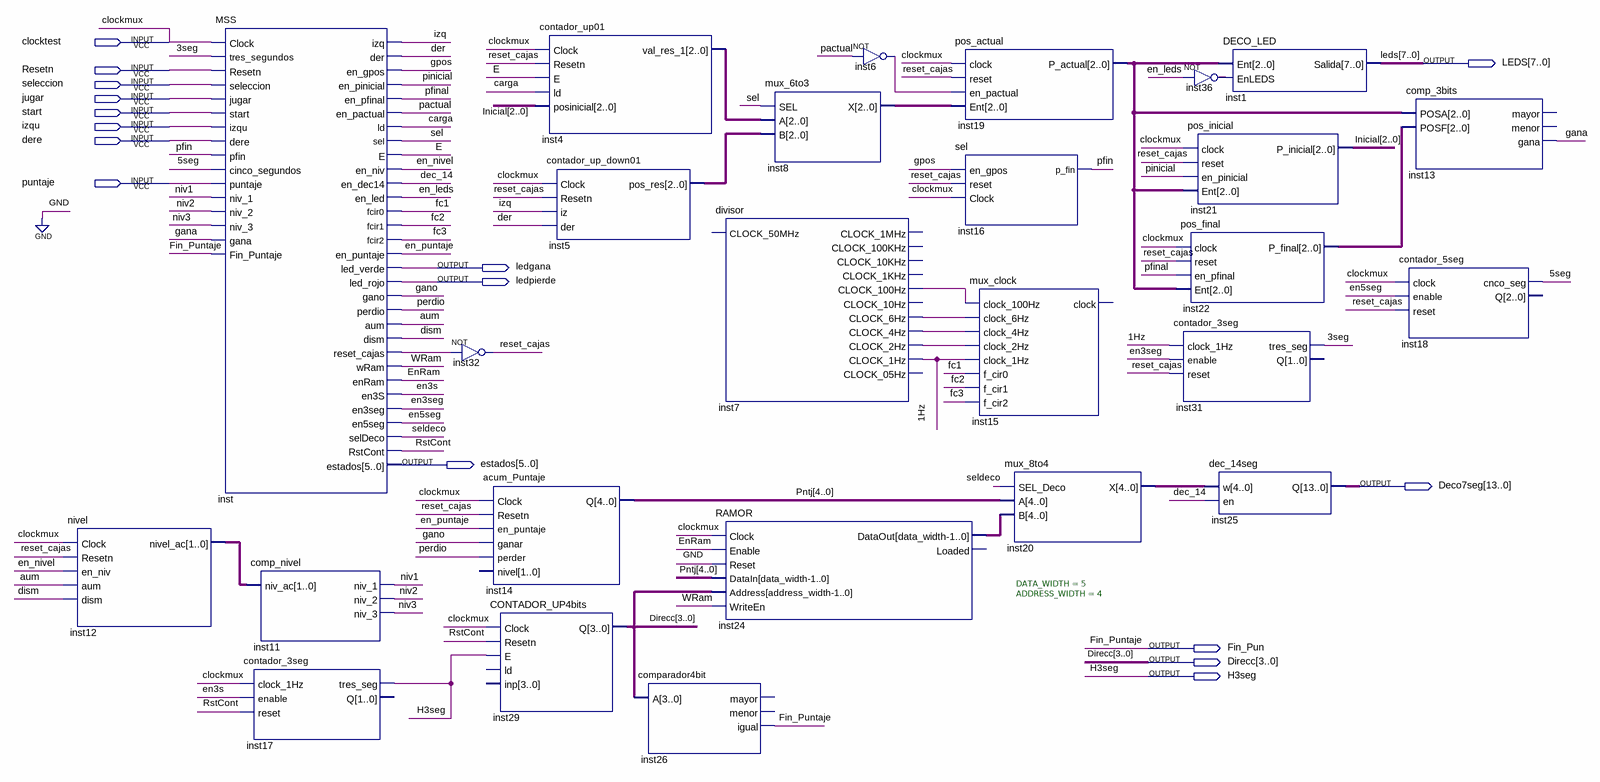
[diagram p0: schematic sheet]
// Quartus schematic diagrama_bloques2.bdf as structural Verilog: 26 symbols, 16 pins
module diagrama_bloques2 (
  input  clocktest,
  input  Resetn,
  input  seleccion,
  input  jugar,
  input  start,
  input  izqu,
  input  dere,
  input  puntaje,
  output [7:0] LEDS,
  output ledgana,
  output ledpierde,
  output [5:0] estados,
  output [13:0] Deco7seg,
  output Fin_Pun,
  output [3:0] Direcc,
  output H3seg
);

  wire \1Hz , \3seg , \5seg , aum, carga, dec_14, der, dism, E, en3s, en3seg, en5seg, en_leds, en_nivel,
       en_puntaje, EnRam, fc1, fc2, fc3, gana, gano, gpos, inst6_out, inst7_clock_2hz, inst7_clock_4hz,
       inst7_clock_6hz, inst7_clock_100hz, inst36_out, inst_reset_cajas, izq, niv1, niv2, niv3, pactual,
       perdio, pfin, pfinal, pinicial, reset_cajas, RstCont, sel, seldeco, WRam;
  wire [1:0] inst12_nivel_ac;
  wire [2:0] Inicial, inst4_val_res_1, inst5_pos_res, inst8_x, inst19_p_actual, inst22_p_final;
  wire [4:0] inst20_x, inst24_dataout, Pntj;

  nivel inst12 (
    .Clock(clocktest), .Resetn(reset_cajas), .en_niv(en_nivel), .aum(aum), .dism(dism),
    .nivel_ac(inst12_nivel_ac));
  MSS inst (
    .Clock(clocktest), .tres_segundos(\3seg ), .Resetn(Resetn), .seleccion(seleccion), .jugar(jugar),
    .start(start), .izqu(izqu), .dere(dere), .pfin(pfin), .cinco_segundos(\5seg ), .puntaje(puntaje),
    .niv_1(niv1), .niv_2(niv2), .niv_3(niv3), .gana(gana), .Fin_Puntaje(Fin_Pun), .izq(izq), .der(der),
    .en_gpos(gpos), .en_pinicial(pinicial), .en_pfinal(pfinal), .en_pactual(pactual), .ld(carga), .sel(sel),
    .E(E), .en_niv(en_nivel), .en_dec14(dec_14), .en_led(en_leds), .fcir0(fc1), .fcir1(fc2), .fcir2(fc3),
    .en_puntaje(en_puntaje), .led_verde(ledgana), .led_rojo(ledpierde), .gano(gano), .perdio(perdio),
    .aum(aum), .dism(dism), .reset_cajas(inst_reset_cajas), .wRam(WRam), .enRam(EnRam), .en3S(en3s),
    .en3seg(en3seg), .en5seg(en5seg), .selDeco(seldeco), .RstCont(RstCont), .estados(estados));
  comp_nivel inst11 (.niv_ac(inst12_nivel_ac), .niv_1(niv1), .niv_2(niv2), .niv_3(niv3));
  contador_3seg inst17 (.clock_1Hz(clocktest), .enable(en3s), .reset(RstCont), .tres_seg(H3seg));  // open: Q
  not inst32 (reset_cajas, inst_reset_cajas);
  acum_Puntaje inst14 (
    .Clock(clocktest), .Resetn(reset_cajas), .en_puntaje(en_puntaje), .ganar(gano), .perder(perdio), .Q(Pntj));  // open: nivel
  CONTADOR_UP4bits inst29 (.Clock(clocktest), .Resetn(RstCont), .E(H3seg), .Q(Direcc));  // open: ld, inp
  contador_up01 inst4 (
    .Clock(clocktest), .Resetn(reset_cajas), .E(E), .ld(carga), .posinicial(Inicial),
    .val_res_1(inst4_val_res_1));
  contador_up_down01 inst5 (.Clock(clocktest), .Resetn(reset_cajas), .iz(izq), .der(der), .pos_res(inst5_pos_res));
  comparador4bit inst26 (.A(Direcc), .igual(Fin_Pun));  // open: mayor, menor
  divisor inst7 (
    .CLOCK_100Hz(inst7_clock_100hz), .CLOCK_6Hz(inst7_clock_6hz), .CLOCK_4Hz(inst7_clock_4hz),
    .CLOCK_2Hz(inst7_clock_2hz), .CLOCK_1Hz(\1Hz ));  // open: CLOCK_50MHz, CLOCK_1MHz, CLOCK_100KHz, CLOCK_10KHz, CLOCK_1KHz, CLOCK_10Hz, CLOCK_05Hz
  RAMOR #(.DATA_WIDTH(5), .ADDRESS_WIDTH(4)) inst24 (
    .Clock(clocktest), .Enable(EnRam), .Reset(1'b0), .DataIn(Pntj), .Address(Direcc), .WriteEn(WRam),
    .DataOut(inst24_dataout));  // open: Loaded
  mux_6to3 inst8 (.SEL(sel), .A(inst4_val_res_1), .B(inst5_pos_res), .X(inst8_x));
  not inst6 (inst6_out, pactual);
  pos_actual inst19 (
    .clock(clocktest), .reset(reset_cajas), .en_pactual(inst6_out), .Ent(inst8_x), .P_actual(inst19_p_actual));
  sel inst16 (.en_gpos(gpos), .reset(reset_cajas), .Clock(clocktest), .p_fin(pfin));
  mux_clock inst15 (
    .clock_100Hz(inst7_clock_100hz), .clock_6Hz(inst7_clock_6hz), .clock_4Hz(inst7_clock_4hz),
    .clock_2Hz(inst7_clock_2hz), .clock_1Hz(\1Hz ), .f_cir0(fc1), .f_cir1(fc2), .f_cir2(fc3));  // open: clock
  mux_8to4 inst20 (.SEL_Deco(seldeco), .A(Pntj), .B(inst24_dataout), .X(inst20_x));
  contador_3seg inst31 (.clock_1Hz(\1Hz ), .enable(en3seg), .reset(reset_cajas), .tres_seg(\3seg ));  // open: Q
  DECO_LED inst1 (.Ent(inst19_p_actual), .EnLEDS(inst36_out), .Salida(LEDS));
  not inst36 (inst36_out, en_leds);
  pos_inicial inst21 (
    .clock(clocktest), .reset(reset_cajas), .en_pinicial(pinicial), .Ent(inst19_p_actual), .P_inicial(Inicial));
  pos_final inst22 (
    .clock(clocktest), .reset(reset_cajas), .en_pfinal(pfinal), .Ent(inst19_p_actual),
    .P_final(inst22_p_final));
  dec_14seg inst25 (.w(inst20_x), .en(dec_14), .Q(Deco7seg));
  contador_5seg inst18 (.clock(clocktest), .enable(en5seg), .reset(reset_cajas), .cnco_seg(\5seg ));  // open: Q
  comp_3bits inst13 (.POSA(inst19_p_actual), .POSF(inst22_p_final), .gana(gana));  // open: mayor, menor

  // Other names for the same wires on the sheet: clockmux = clocktest; Fin_Puntaje = Fin_Pun
endmodule
